# EAGLE design stanze (EAGLE 7.5.0)
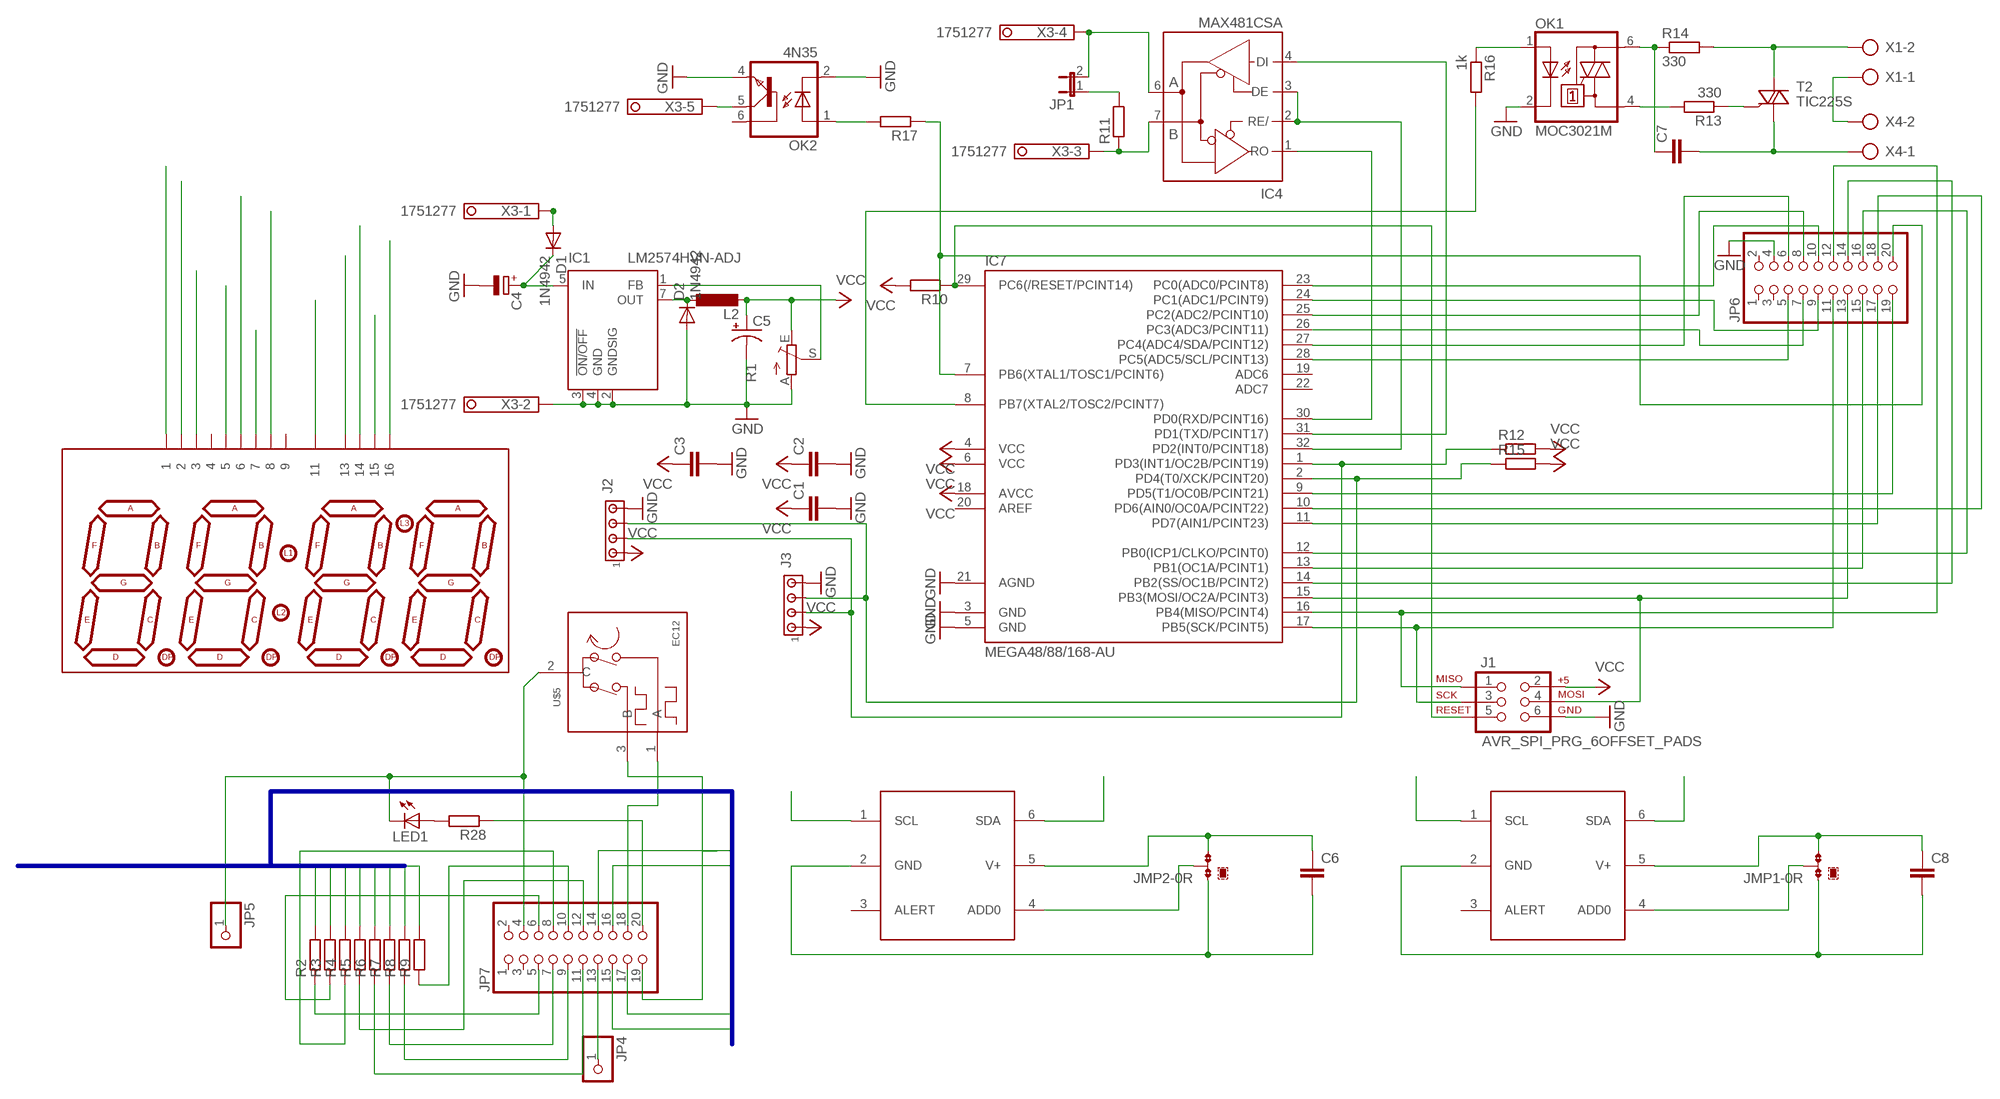
[diagram p0: schematic, sheet 1]

## Parts
C1  C-EUC1206  [C1206]
C2  C-EUC1206  [C1206]
C3  C-EUC1206  [C1206]
C4  CPOL-EUE2,5-6E  [E2,5-6E]
C5  CPOL-USE5-10.5  [E5-10,5]
C6  C-EUC0805  [C0805]
C7  C-EU075-032X103  [C075-032X103]
C8  C-EUC0805  [C0805]
D1  1N4942  [DO41-10]
D2  1N4942  [DO41-10]
IC1  LM2574HVN-ADJ  [DIL08]
IC4  MAX481CSA  [SO08]
IC7  MEGA48/88/168-AU  [TQFP32-08]
J1  AVR_SPI_PRG_6OFFSET_PADS  [2X3_OFFSET]
J2  MTA04-100  [10X04MTA]
J3  MTA04-100  [10X04MTA]
JMP1  0R-JUMPA  [A0R-JMP]
JMP2  0R-JUMPA  [A0R-JMP]
JP1  JP1E  [JP1]
JP4  PINHD-1X1  [1X01]
JP5  PINHD-1X1  [1X01]
JP6  PINHD-2X10  [2X10]
JP7  PINHD-2X10  [2X10]
L2  L-EUTFI0305  [TFI0305]
LED1  LED5MM  [LED5MM]
OK1  MOC3021M  [DIL06]
OK2  4N35  [DIL06]
R1  TRIM_EU-B64Y  [B64Y]
R2  R-EU_0207/10  [0207/10]
R3  R-EU_0207/10  [0207/10]
R4  R-EU_0207/10  [0207/10]
R5  R-EU_0207/10  [0207/10]
R6  R-EU_0207/10  [0207/10]
R7  R-EU_0207/10  [0207/10]
R8  R-EU_0207/10  [0207/10]
R9  R-EU_0207/10  [0207/10]
R10  R-EU_0207/10  [0207/10]
R11  R-EU_0207/10  [0207/10]
R12  R-EU_0207/10  [0207/10]
R13  330  R-EU_0207/10  [0207/10]
R14  330  R-EU_0207/10  [0207/10]
R15  R-EU_0207/10  [0207/10]
R16  1k  R-EU_0207/10  [0207/10]
R17  R-EU_0207/10  [0207/10]
R28  R-EU_0207/10  [0207/10]
T2  TIC225S  [TO220DS]
U$1  TMP112  [SOT563]
U$2  TMP112  [SOT563]
U$3  7-SEGMENT-4DIGITPTH  [7-SEGMENT-4DIGIT]
U$5  EC12  [EC12]
X1  AK500/2  [AK500/2]
X3  1751277  [1751277]
X4  AK500/2  [AK500/2]

## Nets
DISPLAY1: R2.2 U$3.14
DISPLAY2: R3.2 U$3.16
DISPLAY3: R4.2 U$3.13
DISPLAY4: R5.2 U$3.3
DISPLAY5: R6.2 U$3.5
DISPLAY6: R7.2 U$3.11
DISPLAY7: R8.2 U$3.15
DISPLAY8: R9.2 U$3.7
GND: C1.2 C2.2 C3.2 C4.- C5.- D2.A IC1.2(GNDSIG) IC1.3(!ON/OFF) IC1.4(GND) IC7.3(GND) IC7.5(GND) IC7.21(AGND) J1.6 J2.4 J3.4 JP6.4 OK1.2(C) OK2.2(C) OK2.4(EMI) R1.A X3.2
N$1: C7.1 OK1.6(A2) R14.1
N$2: JMP2.2 U$1.4(ADD0)
N$3: IC7.9(PD5(T1/OC0B/PCINT21)) JP6.19
N$4: IC7.10(PD6(AIN0/OC0A/PCINT22)) JP6.18
N$5: IC7.1(PD3(INT1/OC2B/PCINT19)) J2.2 J3.2 R12.1
N$6: IC7.2(PD4(T0/XCK/PCINT20)) J2.3 J3.3 R15.1
N$7: OK2.1(A) R17.2
N$8: IC7.8(PB7(XTAL2/TOSC2/PCINT7)) R16.2
N$9: IC7.7(PB6(XTAL1/TOSC1/PCINT6)) JP6.20 R17.1
N$10: IC7.17(PB5(SCK/PCINT5)) J1.3 JP6.11
N$11: IC7.29(PC6(/RESET/PCINT14)) J1.5 R10.1
N$12: C8.1 JMP1.3 U$2.5(V+)
N$13: IC7.11(PD7(AIN1/PCINT23)) JP6.17
N$14: JP7.5 R2.1
N$15: IC7.15(PB3(MOSI/OC2A/PCINT3)) J1.4 JP6.13
N$16: OK2.5(COL) X3.5
N$17: IC7.12(PB0(ICP1/CLKO/PCINT0)) JP6.16
N$18: IC7.13(PB1(OC1A/PCINT1)) JP6.15
N$20: IC7.14(PB2(SS/OC1B/PCINT2)) JP6.14
N$22: IC7.23(PC0(ADC0/PCINT8)) JP6.10
N$23: IC7.28(PC5(ADC5/SCL/PCINT13)) JP6.5
N$24: JP7.6 R3.1
N$25: R13.1 T2.G
N$26: C6.1 JMP2.3 U$1.5(V+)
N$27: IC7.24(PC1(ADC1/PCINT9)) JP6.9
N$28: OK1.4(A1) R13.2
N$29: IC4.4(DI) IC7.31(PD1(TXD/PCINT17))
N$30: IC4.1(RO) IC7.30(PD0(RXD/PCINT16))
N$31: IC4.2(RE/) IC4.3(DE) IC7.32(PD2(INT0/PCINT18))
N$32: JP7.18 U$5.1(A)
N$33: IC7.26(PC3(ADC3/PCINT11)) JP6.7
N$34: IC4.7(B) R11.1 X3.3
N$35: IC4.6(A) JP1.2 X3.4
N$36: D2.C IC1.7(OUT) L2.1
N$37: IC1.1(FB) R1.S
N$38: C4.+ D1.C IC1.5(IN)
N$40: JP1.1 R11.2
N$41: D1.A X3.1
N$44: U$2.1(SCL)
N$45: U$2.6(SDA)
N$47: IC7.25(PC2(ADC2/PCINT10)) JP6.8
N$48: JP7.7 R7.1
N$49: R14.2 T2.A2 X1.2
N$50: IC7.16(PB4(MISO/PCINT4)) J1.1 JP6.12
N$51: JP7.8 R4.1
N$52: JP7.9 R8.1
N$53: JP7.10 R9.1
N$54: JP7.11 R6.1
N$55: JP7.12 R5.1
N$56: JP4.1 JP7.13
N$57: C7.2 T2.A1 X4.1
N$58: X1.1 X4.2
N$59: OK1.1(A) R16.1
N$61: IC7.27(PC4(ADC4/SDA/PCINT12)) JP6.6
N$62: JP7.19 U$5.3(B)
N$63: JP5.1 JP7.4 LED1.K(C) U$5.2(C)
N$64: JP7.20 R28.1
N$65: LED1.A R28.2
N$67: C6.2 JMP2.1 U$1.2(GND)
N$74: JMP1.2 U$2.4(ADD0)
N$76: C8.2 JMP1.1 U$2.2(GND)
N$102: U$1.6(SDA)
N$121: U$1.1(SCL)
S1: JP7.14 U$3.1
S2: JP7.15 U$3.2
S3: JP7.16 U$3.6
S4: JP7.17 U$3.8
VCC: C1.1 C2.1 C3.1 C5.+ IC7.4(VCC) IC7.6(VCC) IC7.18(AVCC) J1.2 J2.1 J3.1 L2.2 R1.E R10.2 R12.2 R15.2
Unconnected: IC7.19(ADC6) IC7.20(AREF) IC7.22(ADC7) JP6.1 JP6.2 JP6.3 JP7.1 JP7.2 JP7.3 OK2.6(BAS) U$1.3(ALERT) U$2.3(ALERT) U$3.4 U$3.9

## Buses
DISPLAY[1..8],S[1..4]

## Power pins joined to a net without a drawn wire
GND: IC4.5(GND)
VCC: IC4.8(VCC)

## Library data of the parts
C1-C3 C6-C8 = rcl:C-EU: CAPACITOR, European symbol
C4 = rcl:CPOL-EU: POLARIZED CAPACITOR, European symbol
C5 = rcl:CPOL-US: POLARIZED CAPACITOR, American symbol
D1 D2 = diode:1N4942: DIODE 1.0 A, 200 V, 150 ns
IC1 = linear:LM2574?-*: SIMPLE SWITCHER 0.5A Step-Down Voltage Regulator Source: http://cache.national.com/ds/LM/LM2574.pdf
IC4 = maxim:MAX481CSA: RS485 TRANSEIVER; MF: MAXIM; MPN: MAX481CSA; OC_FARNELL: unknown; OC_NEWARK: 90C3817
IC7 = avr-7:MEGA48/88/168
J1 = SparkFun:AVR_SPI_PRG_6: AVR ISP 6 Pin This is the reduced ISP connector for AVR programming. Common on Arduino. This footprint will take up less PCB space and can be used with a 10-pin to 6-pin adapter such as SKU: BOB-08508
J2 J3 = con-amp:MTA04-100: AMP connector
JMP1 JMP2 = jump-0r-smd:0R-JUMP: SMD 0R 0805 Jumper
JP1 = jumper:JP1E: JUMPER
JP4 JP5 = pinhead:PINHD-1X1: PIN HEADER
JP6 JP7 = pinhead:PINHD-2X10: PIN HEADER
L2 = rcl:L-EU: INDUCTOR, European symbol
LED1 = led:LED: LED OSRAM: - CHIPLED LG R971, LG N971, LY N971, LG Q971, LY Q971, LO R971, LY R971 LH N974, LH R974 LS Q976, LO Q976, LY Q976 LO Q996 - Hyper CHIPLED LW Q18S LB Q993, LB Q99A, LB R99A - SideLED LS A670, LO A670, LY A670, LG A670, LP A670 LB A673, LV A673, LT A673, LW A673 LH A674 LY A675 LS A676, LA A676, LO A676, LY A676, LW A676 LS A679, LY A679, LG A679 - Hyper Micro SIDELED® LS Y876, LA Y876, LO Y876, LY Y876 LT Y87S - SmartLED LW L88C, LW L88S LB L89C, LB L89S, LG L890 LS L89K, LO L89K, LY L89K LS L896, LA L896, LO L896, LY L896 - TOPLED LS T670, LO T670, LY T670, LG T670, LP T670 LSG T670, LSP T670, LSY T670, LOP T670, LYG T670 LG T671, LOG T671, LSG T671 LB T673, LV T673, LT T673, LW T673 LH T674 LS T676, LA T676, LO T676, LY T676, LB T676, LH T676, LSB T676, LW T676 LB T67C, LV T67C, LT T67C, LS T67K, LO T67K, LY T67K, LW E67C LS E67B, LA E67B, LO E67B, LY E67B, LB E67C, LV E67C, LT E67C LW T67C LS T679, LY T679, LG T679 LS T770, LO T770, LY T770, LG T770, LP T770 LB T773, LV T773, LT T773, LW T773 LH T774 LS E675, LA E675, LY E675, LS T675 LS T776, LA T776, LO T776, LY T776, LB T776 LHGB T686 LT T68C, LB T68C - Hyper Mini TOPLED® LB M676 - Mini TOPLED Santana® LG M470 LS M47K, LO M47K, LY M47K Source: http://www.osram.convergy.de LUXEON: - LUMILED® LXK2-PW12-R00, LXK2-PW12-S00, LXK2-PW14-U00, LXK2-PW14-V00 LXK2-PM12-R00, LXK2-PM12-S00, LXK2-PM14-U00 LXK2-PE12-Q00, LXK2-PE12-R00, LXK2-PE12-S00, LXK2-PE14-T00, LXK2-PE14-U00 LXK2-PB12-K00, LXK2-PB12-L00, LXK2-PB12-M00, LXK2-PB14-N00, LXK2-PB14-P00, LXK2-PB14-Q00 LXK2-PR12-L00, LXK2-PR12-M00, LXK2-PR14-Q00, LXK2-PR14-R00 LXK2-PD12-Q00, LXK2-PD12-R00, LXK2-PD12-S00 LXK2-PH12-R00, LXK2-PH12-S00 LXK2-PL12-P00, LXK2-PL12-Q00, LXK2-PL12-R00 Source: www.luxeon.com KINGBRIGHT: KA-3528ASYC Source: www.kingbright.com
OK1 = optocoupler:MOC30*M: RANDOM-PHASE OPTOISOLATORS TRIAC DRIVER OUTPUT Source: http://www.fairchildsemi.com MOC3020-M.pdf; MF: FAIRCHILD SEMICONDUCTOR; MPN: MOC3021-M; OC_FARNELL: 1021365; OC_NEWARK: 95B7895
OK2 = optocoupler:4N35: MOTOROLA OPTO COUPLER; MF: FAIRCHILD SEMICONDUCTOR; MPN: 4N35; OC_FARNELL: 1328375; OC_NEWARK: 72K9946
R1 = pot:TRIM_EU-: POTENTIOMETER
R2-R17 R28 = rcl:R-EU_: RESISTOR, European symbol
T2 = triac:TIC225S: TRIAC
U$1 U$2 = texas:TMP112
U$3 = SparkFun:7-SEGMENT-4DIGIT
U$5 = rotary-encoder:EC12
X1 X4 = con-ptr500:AK500/2: CONNECTOR
X3 = con-phoenix-350:1751277: MKDS 1/ 5-3,5 Printklemme Nennstrom: 10 A Bemessungsspannung: 160 V Raster: 3,5 mm Polzahl: 5 Montageart: Löten Anschlussart: Schraubanschluss Anschlussrichtung vom Leiter zur Platine: 0° Source: http://eshop.phoenixcontact.com .. 1751277.pdf; OC_FARNELL: unknown; OC_NEWARK: unknown

## Board
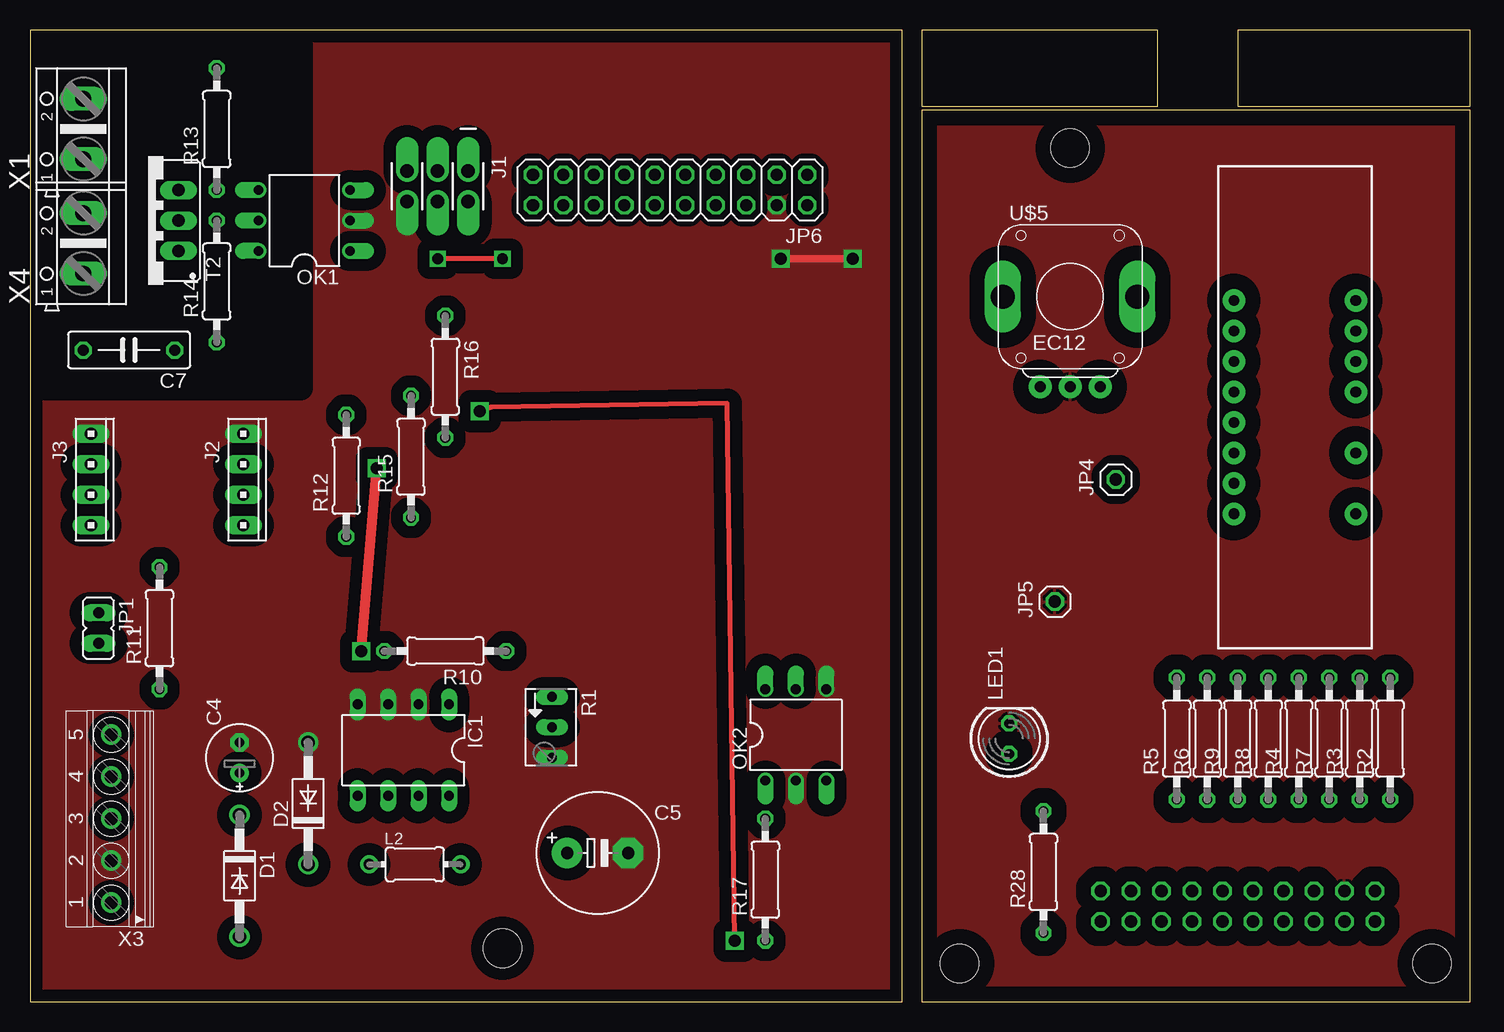
[diagram p1: board, top side]
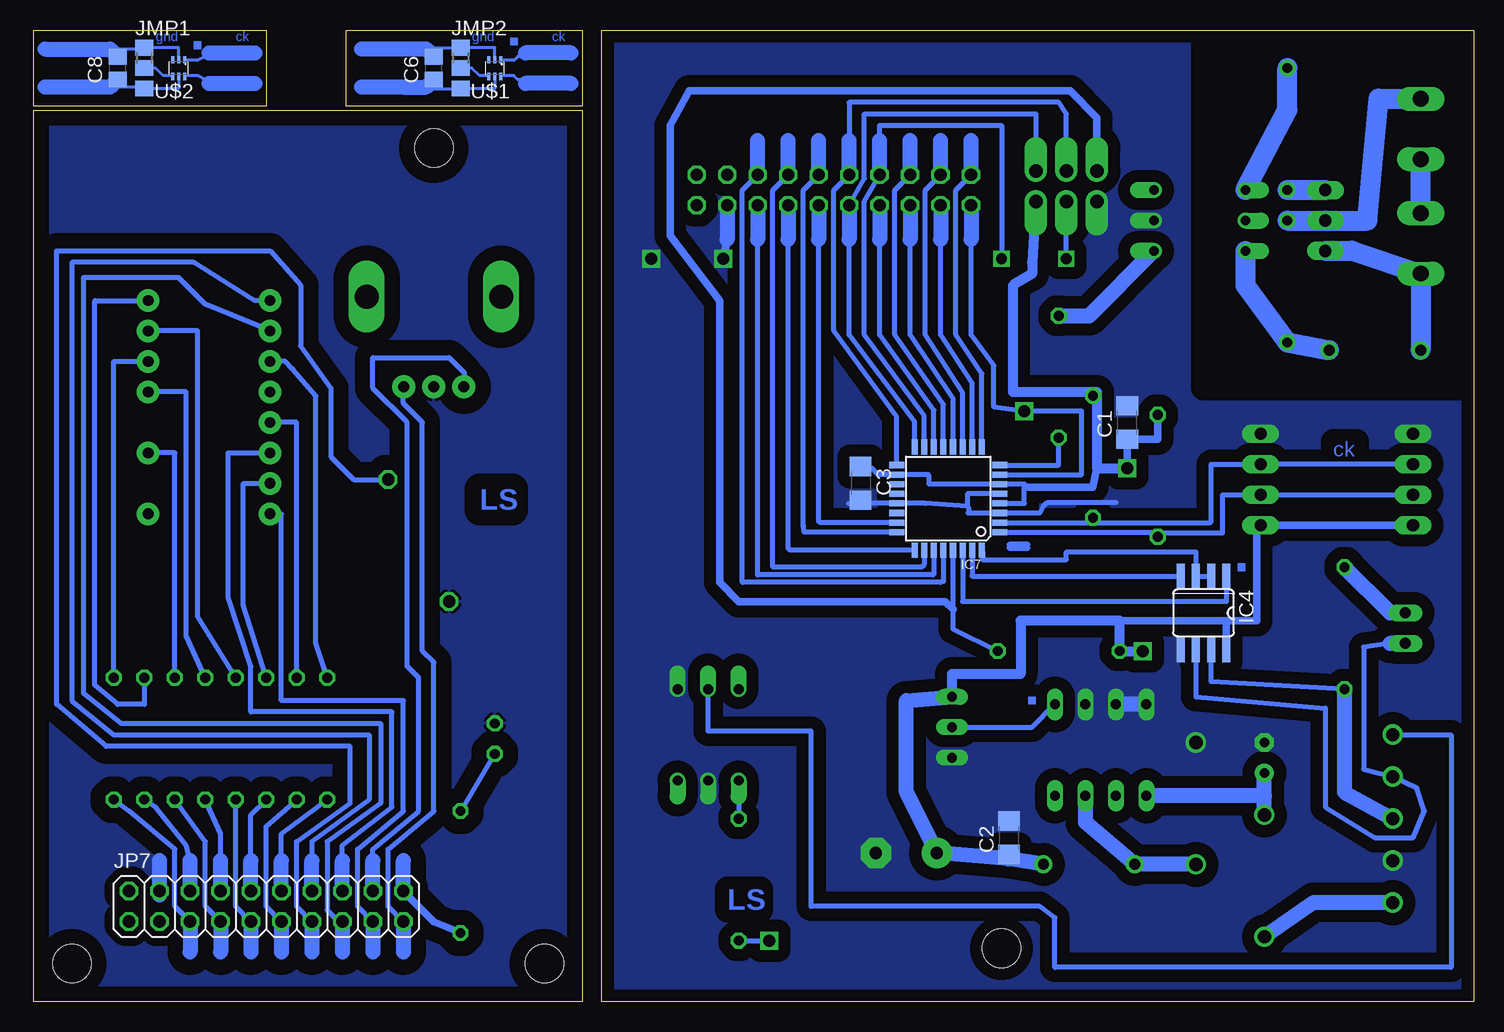
[diagram p2: board, bottom side, seen from below]

Size 120.02 x 80.96 mm. Coordinates in mm from the lower left corner, seen from the top.
Outline: 0,0 72.69,0 72.69,80.95 0,80.95 0,0
Outline: 74.3,74.3 74.3,0 120.02,0 120.02,74.3 74.3,74.3
Outline: 74.3,80.96 74.3,74.61 93.98,74.61 93.98,80.96 74.3,80.96
Outline: 100.65,80.96 100.65,74.61 120.02,74.61 120.02,80.96 100.65,80.96
Copper layers (1*16): Top 0.035mm / dielectric 1.5mm / Bottom 0.035mm
Design rules "default": minimum track width 10mil, minimum drill 24mil, track to track 8mil, track to pad 8mil, pad to pad 8mil, via to via 8mil, smd to smd 8mil, copper to edge 40mil, drill to drill 8mil, minimum pad ring 10mil, minimum via ring 8mil, stop-mask expansion 4mil, vias tented up to drill 0mil, thermal gap 10mil
Holes 3.2 mm at 86.68,71.12 116.84,3.17 77.47,3.17 39.37,4.45
tRestrict: area 0,51.1 to 22.5,79.7
bRestrict: area 0,51.1 to 22.5,79.7; area 40.6,38.7 to 47,45.1

### Footprints (pad centres in the part's own frame; a part is rotated, then mirrored left to right if it is on the bottom)
C1206 = smd 1.6 x 1.8: 1 -1.4,0; 2 1.4,0
E2,5-6E = drill 0.813 pad 1.575: + -1.27,0 | drill 0.813 pad 1.575 octagon: - 1.27,0
E5-10,5 = drill 1.016 pad 2.54: + -2.54,0 | drill 1.016 pad 2.54 octagon: - 2.54,0
C0805 = smd 1.3 x 1.5: 1 -0.95,0; 2 0.95,0
C075-032X103 = drill 0.914 octagon: 1 -3.81,0; 2 3.81,0
DO41-10 = drill 1.118: A 5.08,0; C -5.08,0
DIL08 = drill 0.813 long: 1 -3.81,-3.81; 2 -1.27,-3.81; 3 1.27,-3.81; 4 3.81,-3.81; 5 3.81,3.81; 6 1.27,3.81; 7 -1.27,3.81; 8 -3.81,3.81
SO08 = smd 0.66 x 2.032: 1 -1.905,-3.073; 2 -0.635,-3.073; 3 0.635,-3.073; 4 1.905,-3.073; 5 1.905,3.073; 6 0.635,3.073; 7 -0.635,3.073; 8 -1.905,3.073
TQFP32-08 = smd 1.27 x 0.508: 1 -4.293,2.8; 2 -4.293,2; 3 -4.293,1.2; 4 -4.293,0.4; 5 -4.293,-0.4; 6 -4.293,-1.2; 7 -4.293,-2; 8 -4.293,-2.8; 17 4.293,-2.8; 18 4.293,-2; 19 4.293,-1.2; 20 4.293,-0.4; 21 4.293,0.4; 22 4.293,1.2; 23 4.293,2; 24 4.293,2.8 | smd 0.508 x 1.27: 9 -2.8,-4.293; 10 -2,-4.293; 11 -1.2,-4.293; 12 -0.4,-4.293; 13 0.4,-4.293; 14 1.2,-4.293; 15 2,-4.293; 16 2.8,-4.293; 25 2.8,4.293; 26 2,4.293; 27 1.2,4.293; 28 0.4,4.293; 29 -0.4,4.293; 30 -1.2,4.293; 31 -2,4.293; 32 -2.8,4.293
2X3_OFFSET = drill 1.118 pad 1.88 offset: 1 -2.54,-1.27; 2 -2.54,1.27; 3 0,-1.27; 4 0,1.27; 5 2.54,-1.27; 6 2.54,1.27
10X04MTA = drill 1.016 long: 1 3.81,0; 2 1.27,0; 3 -1.27,0; 4 -3.81,0
A0R-JMP = smd 1.5 x 1.3: 1 0,1.7; 2 0,0; 3 0,-1.7
JP1 = drill 0.914 long: 1 0,-1.27; 2 0,1.27
1X01 = drill 1.016 octagon: 1 0,0
2X10 = drill 1.016 octagon: 1 -11.43,-1.27; 2 -11.43,1.27; 3 -8.89,-1.27; 4 -8.89,1.27; 5 -6.35,-1.27; 6 -6.35,1.27; 7 -3.81,-1.27; 8 -3.81,1.27; 9 -1.27,-1.27; 10 -1.27,1.27; 11 1.27,-1.27; 12 1.27,1.27; 13 3.81,-1.27; 14 3.81,1.27; 15 6.35,-1.27; 16 6.35,1.27; 17 8.89,-1.27; 18 8.89,1.27; 19 11.43,-1.27; 20 11.43,1.27
TFI0305 = drill 0.9 pad 1.5: 1 -3.81,0; 2 3.81,0
LED5MM = drill 0.813 octagon: A -1.27,0; K 1.27,0
DIL06 = drill 0.813 offset: 1 -2.54,-3.81; 2 0,-3.81; 3 2.54,-3.81; 4 2.54,3.81; 5 0,3.81; 6 -2.54,3.81
B64Y = drill 0.813 long: A 2.54,0; E -2.54,0; S 0,0
0207/10 = drill 0.813 octagon: 1 -5.08,0; 2 5.08,0
TO220DS = drill 1.016 long: A1 -2.54,-2.54; A2 0,-2.54; G 2.54,-2.54
SOT563 = smd 0.254 x 0.6: 1 -0.5,-0.7; 2 0,-0.7; 3 0.5,-0.7; 4 0.5,0.7; 5 0,0.7; 6 -0.5,0.7
7-SEGMENT-4DIGIT = drill 0.9 pad 1.88: 1 -8.89,-5.08; 2 -6.35,-5.08; 3 -3.81,-5.08; 4 -1.27,-5.08; 5 1.27,-5.08; 6 3.81,-5.08; 7 6.35,-5.08; 8 8.89,-5.08; 9 8.89,5.08; 11 3.81,5.08; 13 -1.27,5.08; 14 -3.81,5.08; 15 -6.35,5.08; 16 -8.89,5.08
EC12 = drill 0.9 pad 1.93: 1 -2.5,-7.5; 2 0,-7.5; 3 2.5,-7.5 | drill 2 long: M1 -5.6,0; M2 5.6,0
AK500/2 = drill 1.321 long: 1 -2.515,0; 2 2.515,0
1751277 = drill 1.1 pad 1.7: 1 -7,-0.1; 2 -3.5,-0.1; 3 0,-0.1; 4 3.5,-0.1; 5 7,-0.1

### Placement (x,y rotation side)
C1  28.89,48.26 90 bottom
C2  38.73,13.65 90 bottom
C3  51.12,43.18 270 bottom
C4  17.46,20.32 90 top
C5  47.31,12.38 0 top
C6  86.68,77.79 90 bottom
C7  8.26,54.29 180 top
C8  113.03,77.79 90 bottom
D1  17.46,10.48 270 top
D2  23.18,16.51 90 top
IC1  31.11,20.95 180 top
IC4  22.54,32.38 180 bottom
IC7  43.81,41.91 180 bottom
J1  33.97,67.94 180 top
J2  17.78,43.5 270 top
J3  5.08,43.5 270 top
JMP1  110.81,77.79 0 bottom
JMP2  84.45,77.79 0 bottom
JP1  5.71,31.11 180 top
JP4  90.49,43.5 90 top
JP5  85.41,33.34 90 top
JP6  53.34,67.63 180 top
JP7  100.65,7.94 0 bottom
L2  32.07,11.43 0 top
LED1  81.6,21.91 90 top
OK1  22.86,65.09 90 top
OK2  63.82,22.23 0 top
R1  43.5,22.86 270 top
R2  113.35,21.91 90 top
R3  110.81,21.91 90 top
R4  105.73,21.91 90 top
R5  95.57,21.91 90 top
R6  98.11,21.91 90 top
R7  108.27,21.91 90 top
R8  103.19,21.91 90 top
R9  100.65,21.91 90 top
R10  34.61,29.21 180 top
R11  10.79,31.11 90 top
R12  26.35,43.81 90 top
R13  15.56,72.71 90 top
R14  15.56,60.01 90 top
R15  31.75,45.4 90 top
R16  34.61,52.07 270 top
R17  61.28,10.16 90 top
R28  84.45,10.79 90 top
T2  9.84,65.09 90 top
U$1  81.6,77.79 180 bottom
U$2  107.95,77.79 180 bottom
U$3  105.41,49.53 270 top
U$5  86.68,58.74 0 top
X1  4.45,72.71 90 top
X3  6.67,15.24 90 top
X4  4.45,63.18 90 top

### Tracks (layer width: path | path; a pad name or v marks a point on that pad's centre or on a via)
DISPLAY1
  Bottom 0.406: R2.2 113.35,53.34 U$3.14
DISPLAY2
  Bottom 0.406: R3.2 110.81,24.77 113.03,24.77 114.94,26.35 114.94,58.42 U$3.16
DISPLAY3
  Bottom 0.406: R4.2 107.31,30.48 107.31,50.8 U$3.13
DISPLAY4
  Bottom 0.406: R5.2 96.52,29.84 96.52,50.48 98.42,52.7 99.06,53.34 U$3.3
DISPLAY5
  Bottom 0.406: R6.2 98.11,48.26 U$3.5
DISPLAY6
  Bottom 0.406: R7.2 108.27,45.72 U$3.11
DISPLAY7
  Bottom 0.406: R8.2 106.36,32.07 106.36,55.88 U$3.15
DISPLAY8
  Bottom 0.406: R9.2 102.55,33.02 102.55,43.18 U$3.7
GND  (via drill 1)
  Top 0.61: v62.55,61.91 v68.58,61.91
  Bottom 0.406: 42.23,41.27 45.72,41.51 IC7.21 52.12,41.51 | IC7.5 42.23,42.31 42.23,41.27 | 42.23,41.27 arc90 42.16,40.71 IC7.3 36.2,40.71 35.88,41.27 35.56,41.59 29.84,41.59
  Bottom 0.61: 62.23,63.5 v62.55,61.91
  Bottom 1.27: IC1.4 IC1.3 | JP6.4 62.23,63.5 | X3.2
  pour Top (isolate 1.016, no thermals): 0,80.96 72.71,80.96 72.71,0 0,0
  pour Bottom (isolate 1.016, no thermals): 0,80.96 72.71,80.01 72.71,0.32 0,0
N$1
  Bottom 1.676: OK1.6 19.05,59.69 R14.1 C7.1
N$2
  Bottom 0.254: U$1.4 82.1,77.15 82.87,77.15 83.5,77.79 JMP2.2
N$3
  Bottom 0.406: IC7.9 41.02,52.33 43.18,55.56 43.18,67.63 JP6.19
  Bottom 1.27: JP6.19 41.91,71.75
N$4
  Bottom 0.406: IC7.10 41.81,51.53 44.45,55.56 44.45,63.5
  Bottom 1.27: JP6.18 44.45,63.5
N$5
  Bottom 0.406: J3.2 J2.2 20.95,42.23 20.95,39.05 26.3,39.05 26.35,39.11 | IC7.1 26.35,39.11 | R12.1 26.35,39.11
N$6
  Bottom 0.406: IC7.2 31.75,39.91 | 31.75,39.91 22,39.91 21.91,40.01 21.91,44.77 J2.3 | J3.3 J2.3 | J2.3 18.1,44.77 | R15.1 31.75,39.91
N$7
  Bottom 0.406: OK2.1 R17.2
N$8
  Bottom 0.406: IC7.8 34.61,44.71 R16.2
N$9  (via drill 1)
  Top 0.406: v58.74,5.08 58.1,49.85 38.42,49.53 v37.47,49.21
  Bottom 0.406: IC7.7 32.7,43.91 32.7,49.21 v37.47,49.21 40.01,49.53 40.01,53.02 41.91,55.56 41.91,63.5 | R17.1 v58.74,5.08
  Bottom 1.27: JP6.20 41.91,63.5
N$10
  Bottom 0.406: IC7.17 48.11,48.73 53.34,55.88 53.34,67.63 JP6.11 | J1.3 33.97,73.98 34.61,74.93 52.07,74.93 52.07,71.75
  Bottom 1.27: JP6.11 52.07,71.75
N$11
  Bottom 0.406: IC7.29 43.41,32.7 43.41,31.03 R10.1
  Bottom 0.61: J1.5 31.43,73.66 33.66,75.88 65.41,75.88 66.99,73.03 66.99,63.82 62.87,58.42 62.87,34.92 61.28,33.34 44.05,33.34 43.41,32.7
N$12
  Bottom 0.254: C8.1 113.03,76.2 110.81,76.2 JMP1.3 107.95,76.09 U$2.5
  Bottom 0.305: 113.35,76.52 C8.1
  Bottom 1.27: 119.06,76.2 113.67,76.2 113.35,76.52
N$13
  Bottom 0.406: IC7.11 42.62,50.73 45.72,55.56 45.72,67.63 JP6.17
  Bottom 1.27: JP6.17 44.45,71.75
N$14
  Bottom 0.406: R2.1 112.08,15.88 108.27,12.7 108.27,7.94 JP7.5
  Bottom 1.27: JP7.5 107,4.13
N$15  (via drill 0.9)
  Top 0.406: v39.37,61.91 v33.97,61.91
  Bottom 0.406: IC7.15 45.81,48.8 50.8,55.56 50.8,66.67 JP6.13 | 49.53,71.75 49.53,73.03 39.37,73.03 v39.37,61.91 | v33.97,61.91 J1.4
  Bottom 1.27: JP6.13 49.53,71.75
N$16
  Bottom 0.406: X3.5 1.91,22.23 1.91,2.86 34.92,2.86 34.92,6.99 36.2,7.94 55.24,7.94 55.24,22.54 63.82,22.54 OK2.5
N$17
  Bottom 0.406: IC7.12 43.41,50.25 46.99,55.56 46.99,63.5
  Bottom 1.27: JP6.16 46.99,63.5
N$18
  Bottom 0.406: IC7.13 44.22,49.77 48.26,55.56 48.26,67.63 JP6.15
  Bottom 1.27: JP6.15 46.99,71.75
N$19
  Bottom 1.27: 89.22,76.2 87.31,76.2 87,76.52
N$20
  Bottom 0.406: IC7.14 45.02,49.28 49.53,55.56 49.53,63.5
  Bottom 1.27: JP6.14 49.53,63.5
N$21
  Bottom 0.254: 104.46,76.83 105.41,76.52 105.73,76.83 106.36,77.15 107.31,77.15
  Bottom 1.27: 105.41,76.52 101.6,76.52
N$22
  Bottom 0.406: IC7.23 54.52,39.91 54.61,40.01 54.61,63.5
  Bottom 1.27: JP6.10 54.61,63.5
N$23
  Bottom 0.406: IC7.28 44.22,35.01 44.45,34.92 60.96,34.92 60.96,67.63 JP6.5
  Bottom 1.27: JP6.5 59.69,71.75
N$24  (via drill 1)
  Bottom 0.406: 107,11.75 107.31,13.02 109.86,16.19 R3.1
  Bottom 1.27: JP7.6 107,11.75
  other vias: 107,9.21
N$25
  Bottom 1.676: T2.G R13.1
N$26
  Bottom 0.254: U$1.5 81.6,76.09 JMP2.3 86.68,76.09 C6.1
N$27
  Bottom 0.406: IC7.24 55.82,39.11 55.88,39.69 55.88,67.63 JP6.9
  Bottom 1.27: JP6.9 54.61,71.75
N$28
  Bottom 1.676: OK1.4 15.56,74.3 R13.2
N$29
  Bottom 0.406: IC7.31 41.81,35.46 IC4.4
N$30
  Bottom 0.406: IC4.1 20.64,33.34 42.62,33.34 IC7.30
N$31
  Bottom 0.406: IC7.32 41.02,37.47 40.96,37.47 40.96,36.83 33.97,36.83 33.97,37.47 23.18,37.47 IC4.3 IC4.2
N$32  (via drill 1)
  Bottom 0.406: 91.76,11.75 91.76,12.7 87.95,15.88 87.95,26.99 88.9,27.94 88.9,48.26 91.76,51.12 91.76,53.66 85.41,53.66 84.14,52.39 84.14,51.28 U$5.1
  Bottom 1.27: JP7.18 91.76,11.75
  other vias: 91.76,9.21
N$33
  Bottom 0.406: IC7.26 45.81,36.42 46.04,36.2 58.42,36.2 58.42,67.63 JP6.7
  Bottom 1.27: JP6.7 57.15,71.75
N$34
  Bottom 0.406: R11.1 21.91,26.67 IC4.7
  Bottom 1.27: R11.1 10.79,17.46 X3.3
N$35
  Bottom 0.406: IC4.6 23.18,25.4 12.38,24.45 12.38,16.19 8.26,13.65 5.08,13.65 4.13,15.88 4.76,17.78 X3.4 9.21,19.37 9.21,29.53 6.99,29.84
  Bottom 1.27: JP1.2 6.99,29.84
N$36
  Bottom 1.27: D2.C L2.1 32.38,14.92 IC1.7
N$37
  Bottom 0.406: R1.S 36.83,22.86 IC1.1
N$38
  Bottom 1.27: IC1.5 17.46,17.14 D1.C C4.+
N$39
  Bottom 0.254: 104.46,78.74 105.41,79.06 105.73,78.74 106.36,78.42 107.31,78.42
  Bottom 1.27: 105.41,79.06 101.6,79.06
N$40
  Bottom 1.27: R11.2 6.99,32.38 JP1.1
N$41
  Bottom 1.27: D1.A 13.34,8.26 6.77,8.26 X3.1
N$42
  Bottom 0.406: 37.15,38.1 38.73,38.1 38.73,37.78 37.15,37.78
N$47
  Bottom 0.406: IC7.25 56.98,37.62 57.15,37.78 57.15,63.5
  Bottom 1.27: JP6.8 57.15,63.5
N$48
  Bottom 0.406: R7.1 105.73,13.34 105.73,7.94 JP7.7
  Bottom 1.27: JP7.7 104.46,4.13
N$49
  Bottom 1.27: 5.08,75.25 X1.2
  Bottom 1.676: R14.2 T2.A2 8.89,65.09 7.94,75.25 5.08,75.25
N$50
  Bottom 0.406: IC7.16 46.62,48.32 52.07,55.56 52.07,63.5 | JP6.12 50.8,68.58 50.8,73.98 36.51,73.98 J1.1
  Bottom 1.27: JP6.12 52.07,63.5
N$51  (via drill 1)
  Bottom 0.406: 104.46,11.75 104.46,13.97 R4.1
  Bottom 1.27: JP7.8 104.46,11.75
  other vias: 104.46,9.21
N$52
  Bottom 0.406: JP7.9 103.19,7.94 R8.1
  Bottom 1.27: JP7.9 101.92,4.13
N$53  (via drill 1)
  Bottom 0.406: 101.92,11.75 101.92,15.56 R9.1
  Bottom 1.27: JP7.10 101.92,11.75
  other vias: 101.92,9.21
N$54
  Bottom 0.406: R6.1 100.65,14.61 100.65,7.94 JP7.11
  Bottom 1.27: JP7.11 99.38,4.13
N$55  (via drill 1)
  Bottom 0.406: 99.38,11.75 99.38,13.97 R5.1
  Bottom 1.27: JP7.12 99.38,11.75
  other vias: 99.38,9.21
N$56
  Bottom 0.406: JP7.13 98.11,7.94 98.11,13.34 93.66,16.51 93.66,21.27 113.98,21.27 118.11,24.77 118.11,62.55 100.33,62.55 97.79,59.69 97.79,54.61 95.25,51.12 95.25,45.4 93.34,43.5 JP4.1
  Bottom 1.27: JP7.13 96.84,4.13
N$57
  Bottom 1.676: T2.A1 10.16,62.57 X4.1 C7.2
N$58
  Bottom 1.676: X4.2 X1.1
N$59
  Bottom 1.27: R16.1 32.07,57.15 OK1.1
N$61
  Bottom 0.406: IC7.27 45.02,35.63 45.09,35.56 59.69,35.56 59.69,63.5
  Bottom 1.27: JP6.6 59.69,63.5
N$62
  Bottom 0.406: U$5.3 89.22,51.2 89.22,49.85 87.63,48.26 87.63,29.21 86.68,28.26 86.68,15.88 90.49,12.7 90.49,7.94 JP7.19
  Bottom 1.27: JP7.19 89.22,4.13
N$63
  Bottom 0.406: JP7.4 109.54,11.75 109.54,12.06
  Bottom 1.27: 109.54,8.89 109.54,11.75
  pour Bottom (isolate 1.27): 74.3,74.3 120.02,74.3 120.02,0 74.3,0
  pour Top (isolate 1.27): 74.3,74.3 120.02,74.3 120.02,0 74.3,0
N$64
  Bottom 0.61: R28.1 86.68,6.67 JP7.20
  Bottom 1.27: JP7.20 89.22,11.75
N$65
  Bottom 0.406: LED1.A R28.2
N$67
  Bottom 0.254: U$1.2 81.6,79.49 JMP2.1 86.68,79.49 C6.2 87,79.06
  Bottom 1.27: 92.71,79.38 87.31,79.38 87,79.06
N$68
  Bottom 1.27: 75.25,79.06 79.06,79.06
N$69
  Bottom 1.27: 75.25,76.52 79.06,76.52
N$70
  Bottom 1.27: 89.53,76.2 92.71,76.2
N$71
  Bottom 0.254: 78.11,76.83 79.69,76.83 80.01,77.15 80.96,77.15
N$72
  Bottom 0.254: 78.11,78.74 79.69,78.74 80.01,78.42 80.96,78.42
N$74
  Bottom 0.254: U$2.4 108.45,77.15 109.22,77.15 109.86,77.79 JMP1.2
N$76
  Bottom 0.254: C8.2 113.03,79.38 110.81,79.38 JMP1.1 107.95,79.49 U$2.2
  Bottom 0.305: 113.35,79.06 C8.2
  Bottom 1.27: 119.06,79.38 113.67,79.38 113.35,79.06
S1  (via drill 1)
  Bottom 0.406: U$3.1 101.6,58.42 106.68,61.59 116.84,61.59 116.84,25.08 113.35,22.23 92.08,22.23 92.08,16.83 96.84,13.34 96.84,11.75
  Bottom 1.27: JP7.14 96.84,11.75
  other vias: 96.84,9.21
S2
  Bottom 0.406: U$3.2 105.73,58.1 107.95,60.33 115.89,60.33 115.89,25.72 112.71,23.18 91.12,23.18 91.12,16.51 95.57,13.34 95.57,7.62 94.61,6.67 JP7.15
  Bottom 1.27: JP7.15 94.3,4.13
S3  (via drill 1)
  Bottom 0.406: 94.3,11.75 94.3,13.02 90.17,16.19 90.17,24.13 101.92,24.13 101.92,27.94 103.82,33.66 103.82,45.72 U$3.6
  Bottom 1.27: JP7.16 94.3,11.75
  other vias: 94.3,9.21
S4
  Bottom 0.406: JP7.17 93.03,7.94 93.03,12.7 89.22,15.88 89.22,25.08 99.38,25.08 99.38,40.64 U$3.8
  Bottom 1.27: JP7.17 91.76,4.13
VCC  (via drill 1)
  Top 0.813: v27.62,29.21 v28.89,44.45
  Bottom 0.406: IC7.4 37.47,41.51 37.47,43.11 | 37.15,42.86 37.47,43.11 | 37.47,43.11 IC7.6 45.4,43.11 45.4,43.81 45.5,43.91 IC7.18 49.62,43.91 50.16,44.45 50.99,44.45 C3.1 | C2.1 38.73,11.94 38.77,11.9 | R15.2 31.43,50.48
  Bottom 0.61: 29.53,31.75 20.64,31.75 | 20.64,31.75 IC4.8 | 31.43,44.45 31.75,42.86 37.15,42.86 | 20.64,31.75 18.1,31.75 18.1,39.69 J2.1 J3.1 | v28.89,44.45 C1.1 26.35,46.86 R12.2
  Bottom 0.813: v27.62,29.21 R10.2 29.53,31.75 37.78,31.75 37.78,27.3 43.5,27.3 R1.E | J1.2 36.83,61.59 36.83,60.64 38.42,59.69 38.42,50.8 31.43,50.8 31.43,50.48 31.43,44.45 v28.89,44.45
  Bottom 1.27: L2.2 38.77,11.9 C5.+ 47.31,17.46 47.31,25.08 R1.E
(copper drawn outside any net)
  shapes: Bottom area x4

### Text on the board
Bottom: ck | gnd | ck | gnd | ck | LS | LS